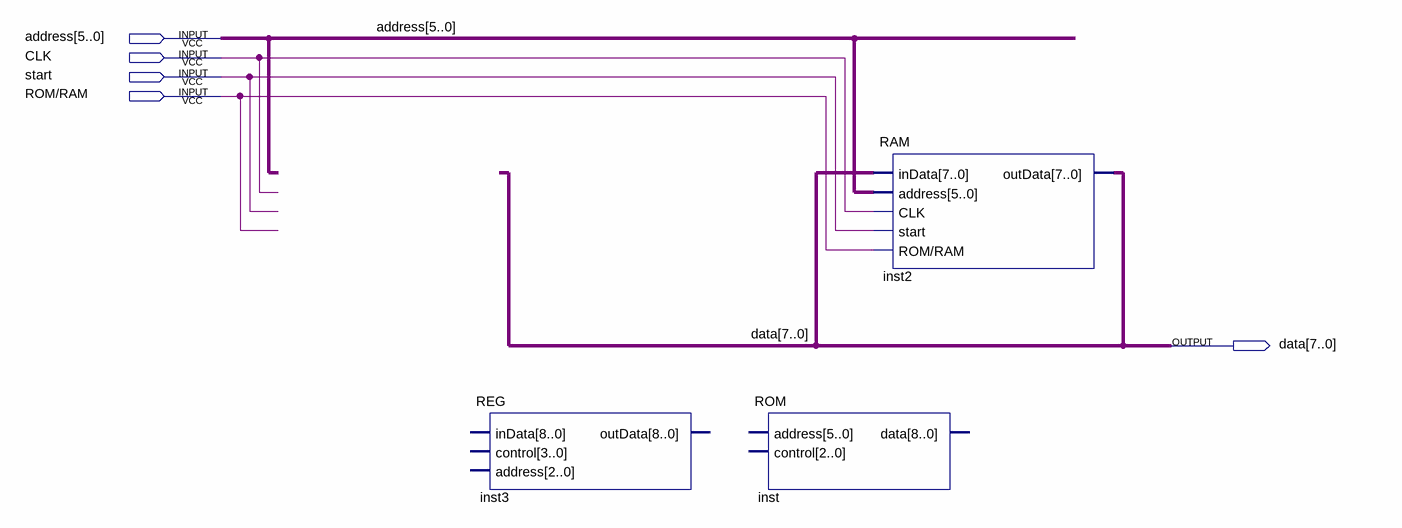
[diagram p0: schematic sheet]
// Quartus schematic Lab4.bdf as structural Verilog: 3 symbols, 5 pins
module Lab4 (
  input  [5:0] address,
  input  CLK,
  input  start,
  input  \ROM/RAM ,
  output [7:0] data
);

  REG inst3 ();  // open: inData, control, address, outData
  ROM inst ();  // open: address, control, data
  RAM inst2 (.inData(data), .address(address), .CLK(CLK), .start(start), .\ROM/RAM (\ROM/RAM ), .outData(data));
endmodule
